# EAGLE design ibmpc (EAGLE 9.6.1)
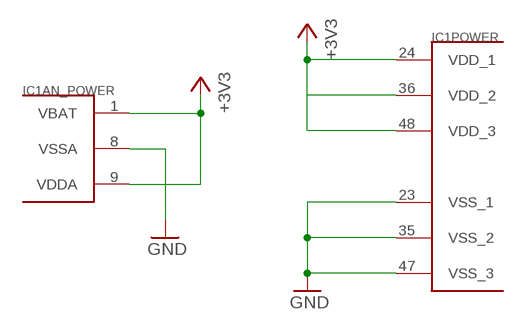
[diagram p0: schematic, sheet 1, part 1 of 2]
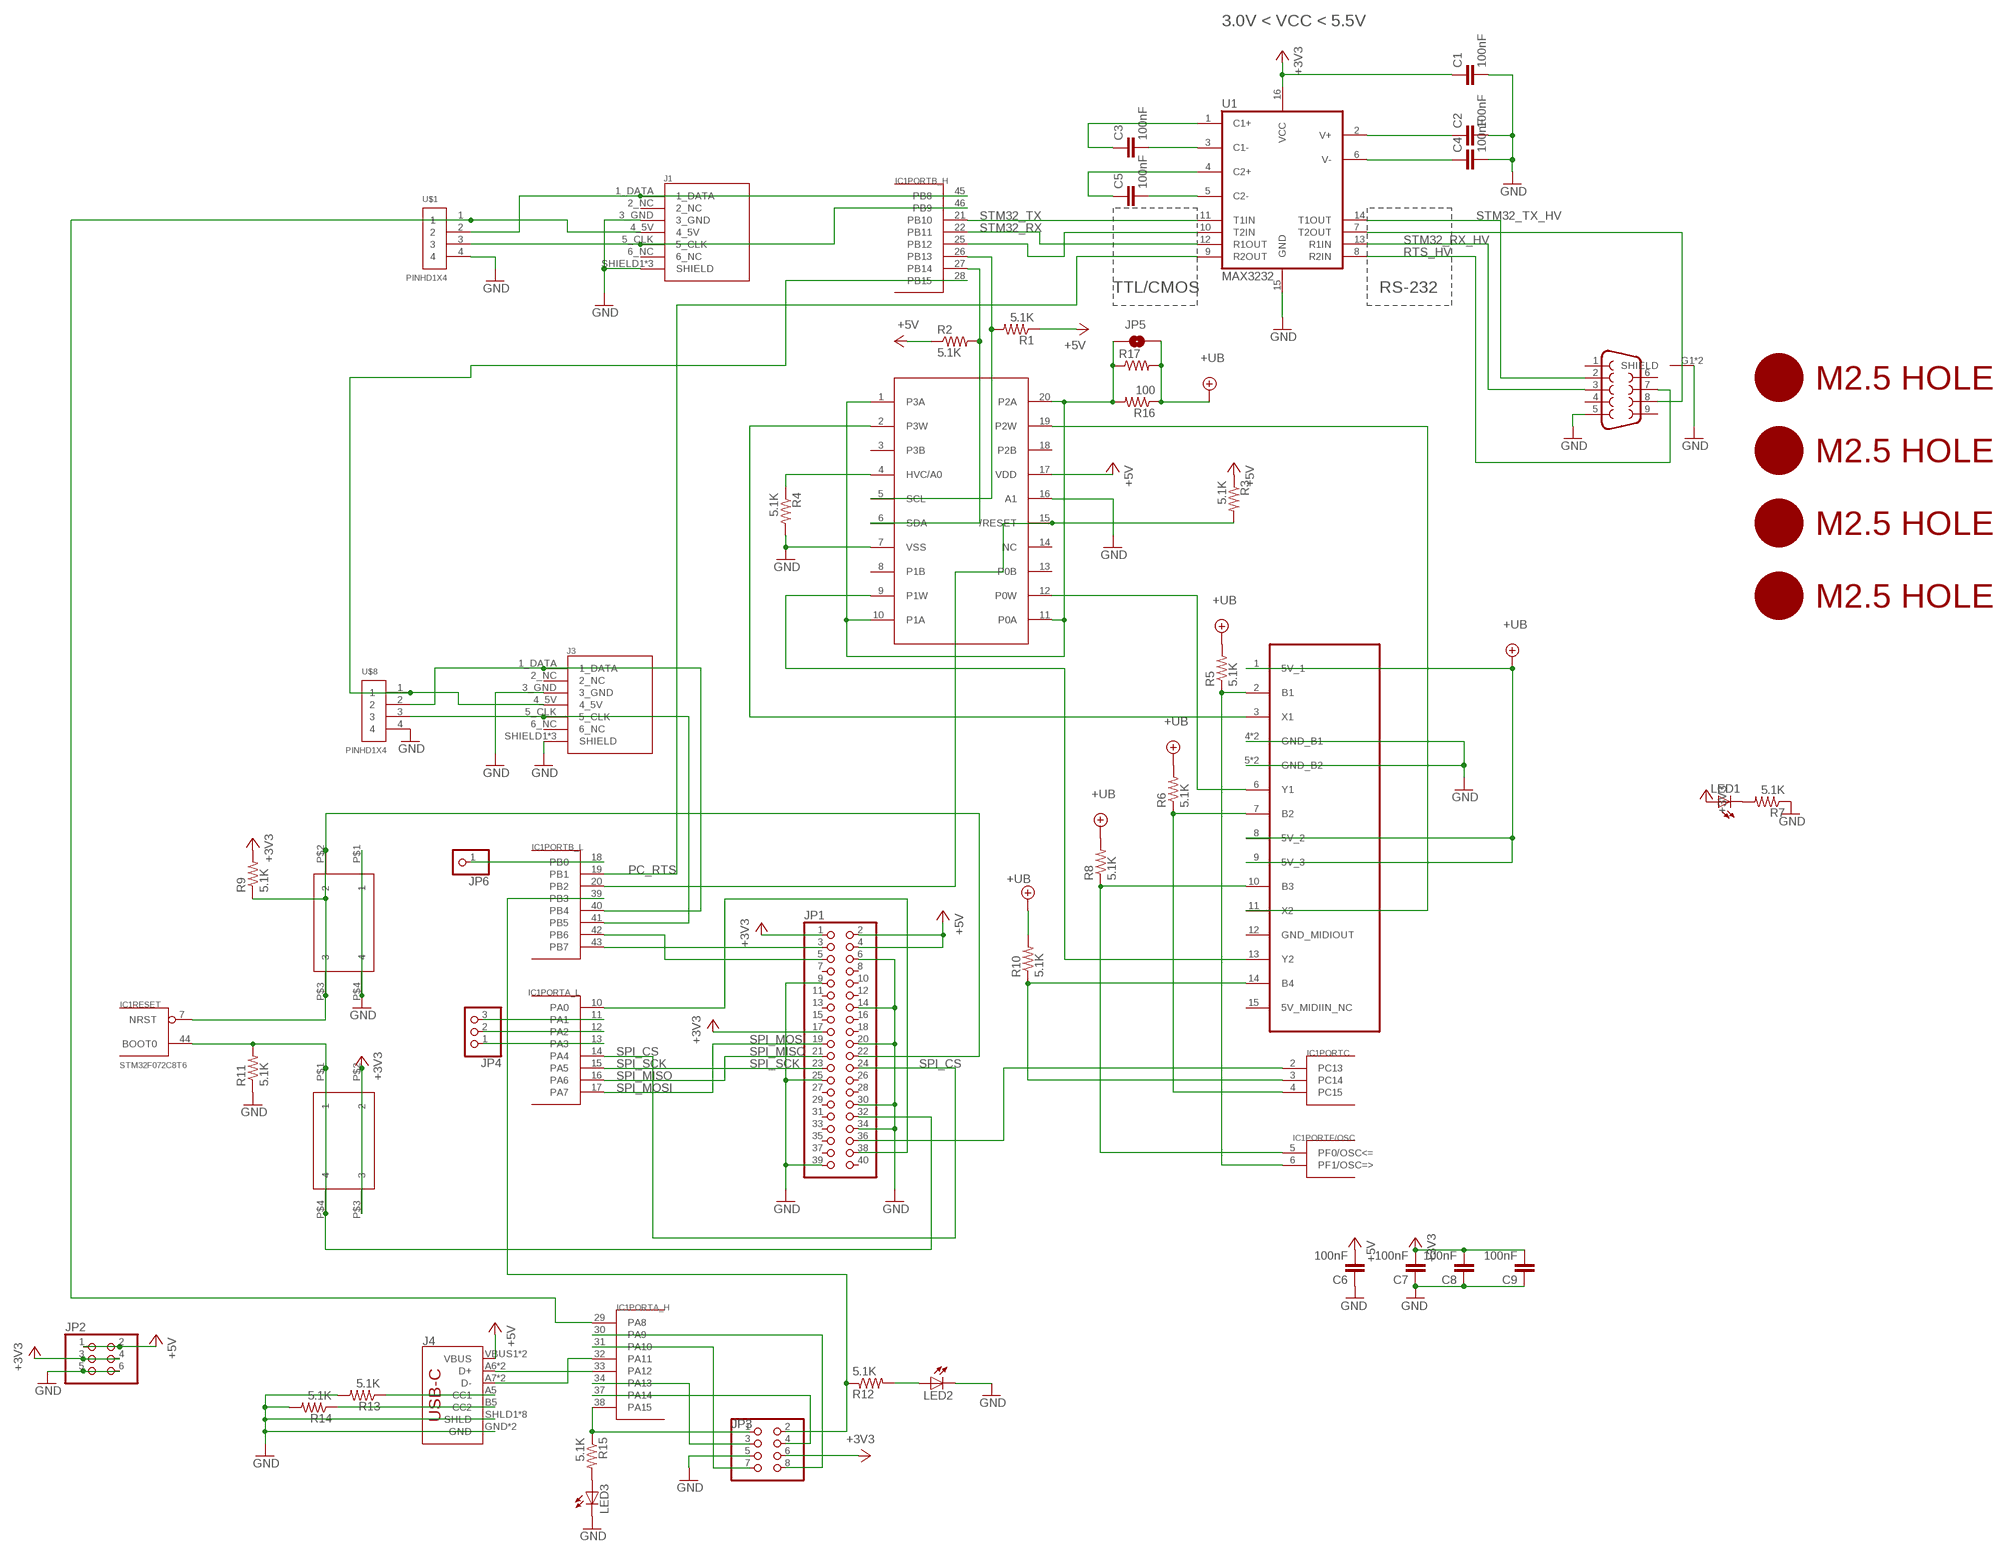
[diagram p1: schematic, sheet 1, part 2 of 2]

## Parts
C1  100nF  CAP0805  [0805@1]
C2  100nF  CAP0805  [0805@1]
C3  100nF  CAP0805  [0805@1]
C4  100nF  CAP0805  [0805@1]
C5  100nF  CAP0805  [0805@1]
C6  100nF  CAP0805  [0805@1]
C7  100nF  CAP0805  [0805@1]
C8  100nF  CAP0805  [0805@1]
C9  100nF  CAP0805  [0805@1]
IC1  STM32F072C8T6  [TQFP48]
J1  DIN7  [DIN7]
J2  DB9MALE  [DB9_MALE]
J3  DIN7  [DIN7]
J4  USB_C16PIN  [USB-C-16P]
JP1  PINHD-2X20-BIG  [2X20-BIG]
JP2  PINHD-2X3  [2X03]
JP3  PINHD-2X4  [2X04]
JP4  PINHD-1X3CB  [1X03-CLEANBIG]
JP5  JUMPER-SMT_2_NO_NO-SILK  [SMT-JUMPER_2_NO_NO-SILK]
JP6  PINHD-1X1CB  [1X01-CLEANBIG]
LED1  LEDCHIP-LED0805  [CHIP-LED0805]
LED2  LEDCHIP-LED0805  [CHIP-LED0805]
LED3  LEDCHIP-LED0805  [CHIP-LED0805]
R1  5.1K  RESISTOR0805-RES  [0805]
R2  5.1K  RESISTOR0805-RES  [0805]
R3  5.1K  RESISTOR0805-RES  [0805]
R4  5.1K  RESISTOR0805-RES  [0805]
R5  5.1K  RESISTOR0805-RES  [0805]
R6  5.1K  RESISTOR0805-RES  [0805]
R7  5.1K  RESISTOR0805-RES  [0805]
R8  5.1K  RESISTOR0805-RES  [0805]
R9  5.1K  RESISTOR0805-RES  [0805]
R10  5.1K  RESISTOR0805-RES  [0805]
R11  5.1K  RESISTOR0805-RES  [0805]
R12  5.1K  RESISTOR0805-RES  [0805]
R13  5.1K  RESISTOR0805-RES  [0805]
R14  5.1K  RESISTOR0805-RES  [0805]
R15  5.1K  RESISTOR0805-RES  [0805]
R16  100  RESISTOR0805-RES  [0805]
R17  R-US_0204/7  [0204/7]
SW1  324_SW  [342_SWICH_FOOT]
SW2  324_SW  [342_SWICH_FOOT]
U1  MAX3232  MAX232SOIC16  [SO016]
U$1  PINHD1X4  [1X04-CLEANBIG]
U$2  M2.5HOLE  [M2.5HOLE]
U$3  M2.5HOLE  [M2.5HOLE]
U$5  MCP4451  [TSSOP20]
U$6  M2.5HOLE  [M2.5HOLE]
U$7  M2.5HOLE  [M2.5HOLE]
U$8  PINHD1X4  [1X04-CLEANBIG]
U$9  GAMEPORT_15P  [DA15]

## Nets
+3V3: C1.1 C7.2 C8.2 C9.2 IC1.1(AN_POWER:VBAT) IC1.9(AN_POWER:VDDA) IC1.24(POWER:VDD_1) IC1.36(POWER:VDD_2) IC1.48(POWER:VDD_3) JP1.1 JP1.17 JP2.3 JP2.4 JP3.6 LED1.A R9.2 SW2.P$2 SW2.P$3 U1.16(VCC)
+5V: C6.2 J4.VBUS1(VBUS) J4.VBUS2(VBUS) JP1.2 JP1.4 JP2.1 JP2.2 R1.1 R2.1 R3.1 U$5.17(VDD)
+UB: JP5.2 R5.2 R6.2 R8.2 R10.2 R16.1 R17.2 U$9.1(5V_1) U$9.8(5V_2) U$9.9(5V_3)
C1+: C3.1 U1.1(C1+)
C1-: C3.2 U1.3(C1-)
C2+: C5.1 U1.4(C2+)
C2-: C5.2 U1.5(C2-)
GND: C1.2 C2.2 C4.2 C6.1 C7.1 C8.1 C9.1 IC1.8(AN_POWER:VSSA) IC1.23(POWER:VSS_1) IC1.35(POWER:VSS_2) IC1.47(POWER:VSS_3) J1.3_GND J1.SHIELD1(SHIELD) J1.SHIELD2(SHIELD) J1.SHIELD3(SHIELD) J2.5 J2.G1(SHIELD) J2.G2(SHIELD) J3.3_GND J3.SHIELD1(SHIELD) J3.SHIELD2(SHIELD) J3.SHIELD3(SHIELD) J4.GND J4.GND2(GND) J4.SHLD1(SHLD) J4.SHLD2(SHLD) J4.SHLD3(SHLD) J4.SHLD4(SHLD) J4.SHLD5(SHLD) J4.SHLD6(SHLD) J4.SHLD7(SHLD) J4.SHLD8(SHLD) JP1.6 JP1.9 JP1.14 JP1.20 JP1.25 JP1.30 JP1.34 JP1.39 JP2.5 JP2.6 JP3.5 LED2.C LED3.C R4.2 R7.1 R11.1 R13.2 R14.2 SW1.P$1 SW1.P$4 U1.15(GND) U$1.4 U$5.7(VSS) U$5.16(A1) U$8.4 U$9.4(GND_B1) U$9.5(GND_B2) U$9.G1(GND_B1) U$9.G2(GND_B2)
N$1: J4.A5(CC1) R13.1
N$2: LED2.A R12.2
N$3: IC1.10(PORTA_L:PA0) JP1.38
N$4: IC1.29(PORTA_H:PA8) J1.4_5V U$1.1
N$5: IC1.41(PORTB_L:PB5) J3.5_CLK U$8.3
N$6: IC1.39(PORTB_L:PB3) JP3.2 R12.1
N$7: J4.B5(CC2) R14.1
N$8: IC1.33(PORTA_H:PA12) J4.A6(D+) J4.B6(D+)
N$9: IC1.32(PORTA_H:PA11) J4.A7(D-) J4.B7(D-)
N$10: IC1.45(PORTB_H:PB8) J1.1_DATA U$1.2
N$11: IC1.46(PORTB_H:PB9) J1.5_CLK U$1.3
N$12: IC1.31(PORTA_H:PA10) JP3.7
N$13: IC1.7(RESET:NRST) JP1.22 R9.1 SW1.P$2 SW1.P$3
N$14: IC1.30(PORTA_H:PA9) JP3.8
N$15: IC1.34(PORTA_H:PA13) JP3.3
N$16: IC1.37(PORTA_H:PA14) JP3.4
N$17: JP5.1 R16.2 R17.1 U$5.1(P3A) U$5.10(P1A) U$5.11(P0A) U$5.20(P2A)
N$18: IC1.44(RESET:BOOT0) JP1.32 R11.2 SW2.P$1 SW2.P$4
N$19: IC1.4(PORTC:PC15) R6.1 U$9.7(B2)
N$20: IC1.5(PORTF/OSC:PF0/OSC<=) R8.1 U$9.10(B3)
N$21: IC1.3(PORTC:PC14) R10.1 U$9.14(B4)
N$22: IC1.42(PORTB_L:PB6) JP1.5
N$23: IC1.43(PORTB_L:PB7) JP1.3
N$24: IC1.25(PORTB_H:PB12) U1.10(T2IN)
N$25: J2.8 U1.7(T2OUT)
N$26: IC1.40(PORTB_L:PB4) J3.1_DATA U$8.2
N$27: IC1.38(PORTA_H:PA15) JP3.1 R15.1
N$28: LED3.A R15.2
N$29: LED1.C R7.2
N$30: IC1.18(PORTB_L:PB0) JP6.1
N$31: IC1.6(PORTF/OSC:PF1/OSC=>) R5.1 U$9.2(B1)
N$32: R4.1 U$5.4(HVC/A0)
N$37: IC1.2(PORTC:PC13) JP1.36
N$39: IC1.11(PORTA_L:PA1) JP4.3
N$40: IC1.12(PORTA_L:PA2) JP4.2
N$41: IC1.13(PORTA_L:PA3) JP4.1
N$43: IC1.28(PORTB_H:PB15) J3.4_5V U$8.1
N$44: IC1.20(PORTB_L:PB2) R3.2 U$5.15(/RESET)
PC_RTS: IC1.19(PORTB_L:PB1) U1.9(R2OUT)
POT_SCL: IC1.26(PORTB_H:PB13) R1.2 U$5.5(SCL)
PST_SDA: IC1.27(PORTB_H:PB14) R2.2 U$5.6(SDA)
RTS_HV: J2.7 U1.8(R2IN)
SPI_CS: IC1.14(PORTA_L:PA4) JP1.24
SPI_MISO: IC1.16(PORTA_L:PA6) JP1.21
SPI_MOSI: IC1.17(PORTA_L:PA7) JP1.19
SPI_SCK: IC1.15(PORTA_L:PA5) JP1.23
STM32_RX: IC1.22(PORTB_H:PB11) U1.12(R1OUT)
STM32_RX_HV: J2.3 U1.13(R1IN)
STM32_TX: IC1.21(PORTB_H:PB10) U1.11(T1IN)
STM32_TX_HV: J2.2 U1.14(T1OUT)
V+: C2.1 U1.2(V+)
V-: C4.1 U1.6(V-)
X1_W3: U$5.2(P3W) U$9.3(X1)
X2_W2: U$5.19(P2W) U$9.11(X2)
Y1_W0: U$5.12(P0W) U$9.6(Y1)
Y2_W1: U$5.9(P1W) U$9.13(Y2)
Unconnected: J1.2_NC J1.6_NC J2.1 J2.4 J2.6 J2.9 J3.2_NC J3.6_NC JP1.7 JP1.8 JP1.10 JP1.11 JP1.12 JP1.13 JP1.15 JP1.16 JP1.18 JP1.26 JP1.27 JP1.28 JP1.29 JP1.31 JP1.33 JP1.35 JP1.37 JP1.40 U$5.3(P3B) U$5.8(P1B) U$5.13(P0B) U$5.14(NC) U$5.18(P2B) U$9.12(GND_MIDIOUT) U$9.15(5V_MIDIIN_NC)

## Notes on the sheet
- 3.0V < VCC < 5.5V
- TTL/CMOS | RS-232

## Library data of the parts
C1-C9 = clock:CAP: Capacitor Standard 0603 ceramic capacitor, and 0.1" leaded capacitor.
IC1 = clock:STM32F072C8T6: ST STM32F072 48pin LQFP
J1 J3 = ibmpc:DIN7: Mini-DIN7 Connector Through-hole MiniDIN 7 connector. Commonly used with Roomba products. Don't confuse this with DIN-6, which is commonly used on oldschool keyboards and mice. Here is the female version connector we sell at SparkFun: MiniDIN 7-Pin Connector <https://www.sparkfun.com/products/696> (PRT-00696); PROD_ID: CONN-08318; SF_ID: PRT-00696
J2 = SparkFun-Connectors:DB9: DB9 Connector Standard DB9 (D-Sub 9) serial connector. Can be used for CAN bus as well as RS485 and RS232. Footprint production proven. Here is the female version connector we sell at SparkFun: 9 Pin Female Serial Connector - PCB Mount <https://www.sparkfun.com/products/429> (PRT-00429) This connector has been used on the following SparkFun products: SparkFun RS232 Shifter - SMD <https://www.sparkfun.com/products/449> (PRT-00449) SparkFun RS232 Shifter SMD (No DB9) <https://www.sparkfun.com/products/8780> (PRT-08780); PROD_ID: CONN-09904
J4 = SparkFun-Connectors:USB_C: USB Type C 16Pin Connector Super Speed pins not available on the 16-pin purely SMD connector so this part is best for USB 2.0 implementations. D1 and D2 are tied together enabling D+/- no matter which way the cable is plugged into the connector. The two channel configuration pins (CC1/2) are exposed. These are normally connected to ground via 5.1k resistors but can be reconfigured for high current/high power applications.; PROD_ID: CONN-14122
JP1 = adafruit_changed:PINHD-2X20: PIN HEADER
JP2 = pinhead:PINHD-2X3: PIN HEADER
JP3 = pinhead:PINHD-2X4: PIN HEADER
JP4 = adafruit:PINHD-1X3: PIN HEADER
JP5 = SparkFun-Jumpers:JUMPER-SMT_2_NO: Normally open jumper This jumper has two pads in close proximity to each other. Apply solder to close the connection. Round pads are easier to solder for beginners, but are a lot larger. SparkFun Product that uses the round pads: SparkFun EL Sequencer <https://www.sparkfun.com/products/12781>
JP6 = adafruit:PINHD-1X1: Pin header 1x1 for 0.1" spacing With round pins
LED1-LED3 = adafruit:LED: LED OSRAM: - CHIPLED LG R971, LG N971, LY N971, LG Q971, LY Q971, LO R971, LY R971 LH N974, LH R974 LS Q976, LO Q976, LY Q976 LO Q996 - Hyper CHIPLED LW Q18S LB Q993, LB Q99A, LB R99A - SideLED LS A670, LO A670, LY A670, LG A670, LP A670 LB A673, LV A673, LT A673, LW A673 LH A674 LY A675 LS A676, LA A676, LO A676, LY A676, LW A676 LS A679, LY A679, LG A679 - Hyper Micro SIDELED® LS Y876, LA Y876, LO Y876, LY Y876 LT Y87S - SmartLED LW L88C, LW L88S LB L89C, LB L89S, LG L890 LS L89K, LO L89K, LY L89K LS L896, LA L896, LO L896, LY L896 - TOPLED LS T670, LO T670, LY T670, LG T670, LP T670 LSG T670, LSP T670, LSY T670, LOP T670, LYG T670 LG T671, LOG T671, LSG T671 LB T673, LV T673, LT T673, LW T673 LH T674 LS T676, LA T676, LO T676, LY T676, LB T676, LH T676, LSB T676, LW T676 LB T67C, LV T67C, LT T67C, LS T67K, LO T67K, LY T67K, LW E67C LS E67B, LA E67B, LO E67B, LY E67B, LB E67C, LV E67C, LT E67C LW T67C LS T679, LY T679, LG T679 LS T770, LO T770, LY T770, LG T770, LP T770 LB T773, LV T773, LT T773, LW T773 LH T774 LS E675, LA E675, LY E675, LS T675 LS T776, LA T776, LO T776, LY T776, LB T776 LHGB T686 LT T68C, LB T68C - Hyper Mini TOPLED® LB M676 - Mini TOPLED Santana® LG M470 LS M47K, LO M47K, LY M47K Source: http://www.osram.convergy.de/
R1-R16 = SparkFun-Passives:RESISTOR: Resistor Basic schematic elements and footprints for 0603, 1206, and PTH resistors.
R17 = adafruit:R-US_: RESISTOR, American symbol
SW1 SW2 = 3pos_slide_switch_centered:324_SW
U1 = SparkFun-DigitalIC:MAX232: RS232 Transceiver Very common IC. This is generically called 'MAX232', but works with the 3V equivalent MAX3232 generic ICs. Field tested and mother approved. Spark Fun Electronics SKU : COM-00316 (DIP) and COM-00589 (SMD); PROD_ID: IC-08171
U$1 U$8 = adafruit_changed:PINHD1X4
U$2 U$3 U$6 U$7 = f1c100s:M2.5HOLE
U$5 = ps2:MCP4451
U$9 = ibmpc:GAMEPORT_15P

## Net classes
1 power: width 0.178 mm

## Board
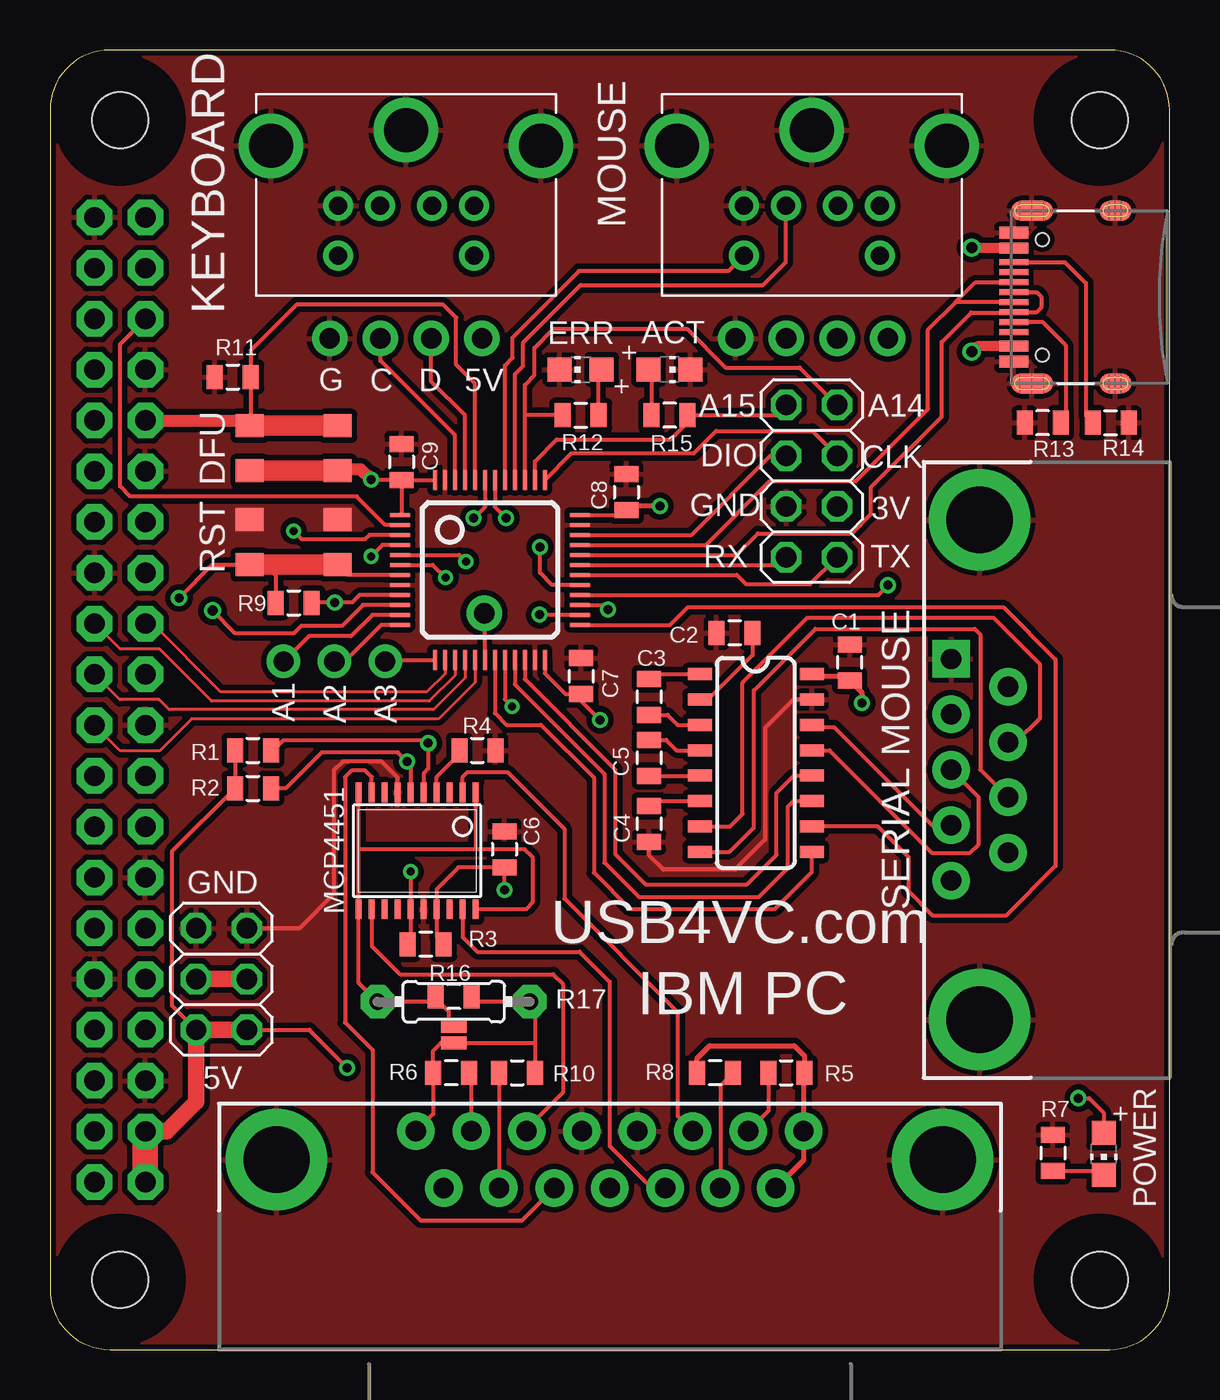
[diagram p2: board, top side]
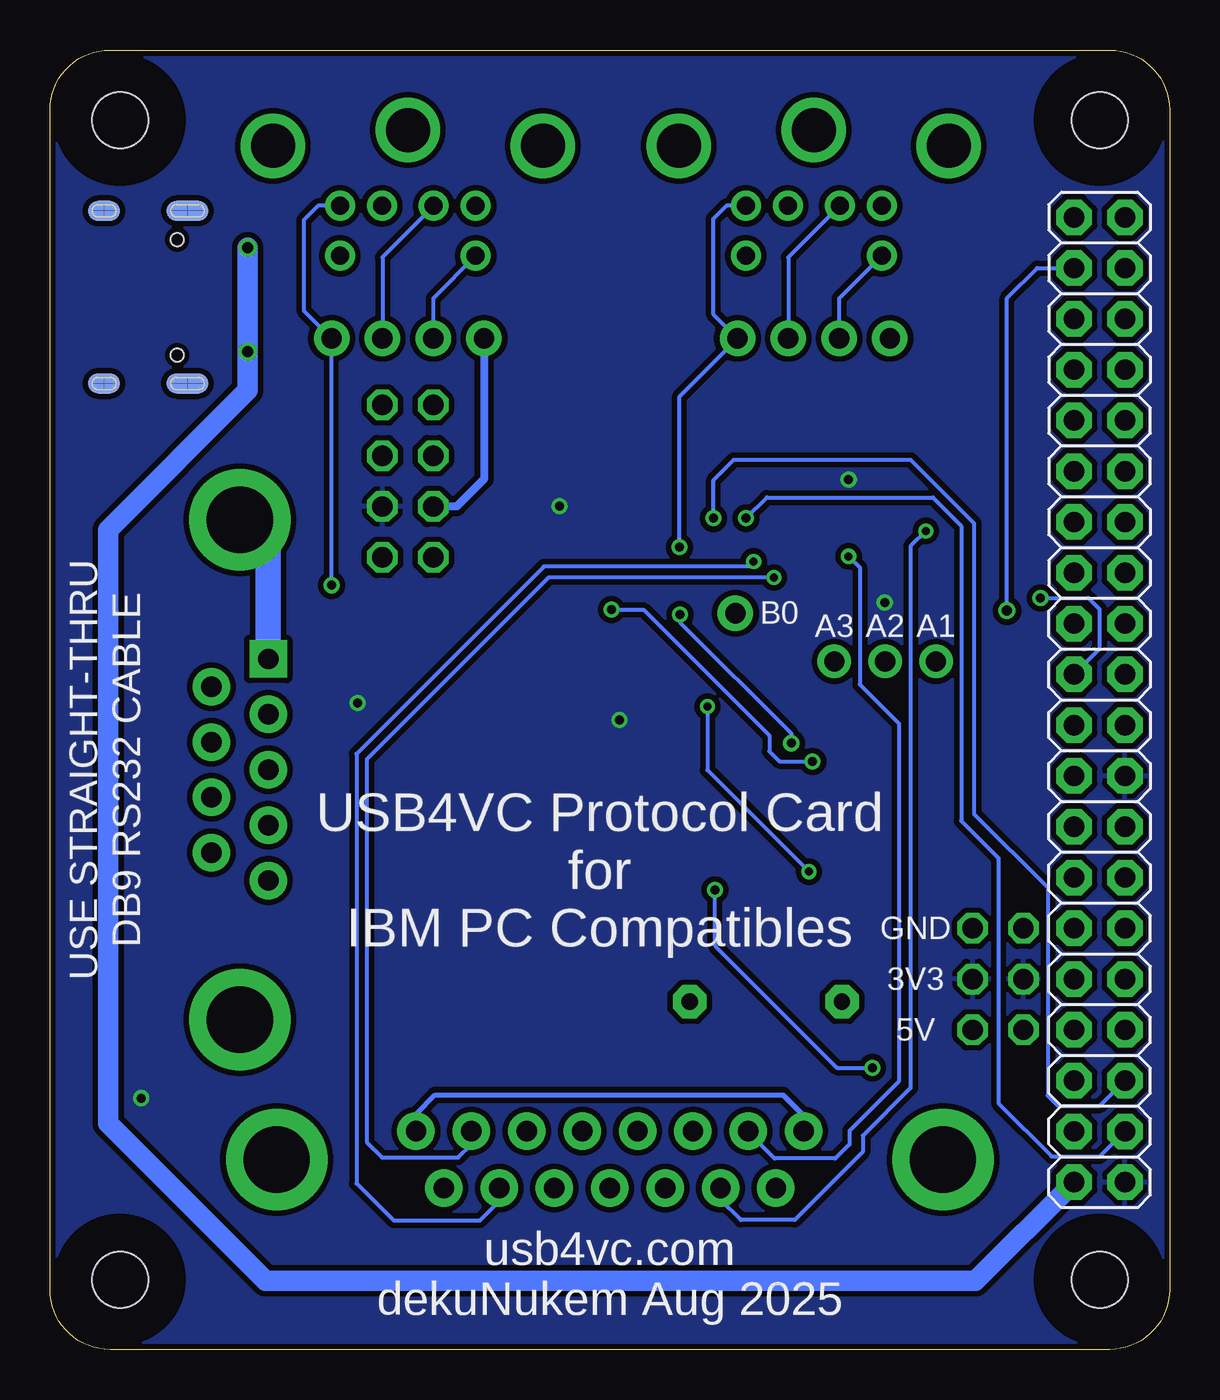
[diagram p3: board, bottom side, seen from below]

Size 56 x 65 mm. Coordinates in mm from the lower left corner, seen from the top.
Outline: 3,0 53,0 arc90 56,3 56,62 arc90 53,65 3,65 arc90 0,62 0,3 arc90 3,0
Copper layers (1*16): Top 0.035mm / dielectric 1.5mm / Bottom 0.035mm
Design rules "deku_2layer_6mil": minimum track width 6mil, minimum drill 15mil, track to track 6mil, track to pad 6mil, pad to pad 6mil, via to via 6mil, smd to smd 6mil, copper to edge 10mil, drill to drill 6mil, minimum pad ring 7mil, minimum via ring 7mil, stop-mask expansion 4mil, vias tented up to drill 25mil, thermal gap 10mil

### Footprints (pad centres in the part's own frame; a part is rotated, then mirrored left to right if it is on the bottom)
0805@1 = smd 0.8 x 1.2: 1 -0.9,0; 2 0.9,0
TQFP48 = smd 0.2 x 1: 1 -2.75,-4.5; 2 -2.25,-4.5; 3 -1.75,-4.5; 4 -1.25,-4.5; 5 -0.75,-4.5; 6 -0.25,-4.5; 7 0.25,-4.5; 8 0.75,-4.5; 9 1.25,-4.5; 10 1.75,-4.5; 11 2.25,-4.5; 12 2.75,-4.5; 25 2.75,4.5; 26 2.25,4.5; 27 1.75,4.5; 28 1.25,4.5; 29 0.75,4.5; 30 0.25,4.5; 31 -0.25,4.5; 32 -0.75,4.5; 33 -1.25,4.5; 34 -1.75,4.5; 35 -2.25,4.5; 36 -2.75,4.5 | smd 1 x 0.2: 13 4.5,-2.75; 14 4.5,-2.25; 15 4.5,-1.75; 16 4.5,-1.25; 17 4.5,-0.75; 18 4.5,-0.25; 19 4.5,0.25; 20 4.5,0.75; 21 4.5,1.25; 22 4.5,1.75; 23 4.5,2.25; 24 4.5,2.75; 37 -4.5,2.75; 38 -4.5,2.25; 39 -4.5,1.75; 40 -4.5,1.25; 41 -4.5,0.75; 42 -4.5,0.25; 43 -4.5,-0.25; 44 -4.5,-0.75; 45 -4.5,-1.25; 46 -4.5,-1.75; 47 -4.5,-2.25; 48 -4.5,-2.75
DIN7 = drill 0.9 pad 1.5: 1_DATA -1.3,-3.8; 2_NC 1.3,-3.8; 3_GND -3.4,-3.8; 4_5V 3.4,-3.8; 5_CLK -3.4,-6.3; 6_NC 3.4,-6.3 | drill 2.2: SHIELD1 -6.75,-0.8; SHIELD2 0,0; SHIELD3 6.75,-0.8
DB9_MALE = drill 1.016 pad 1.88: 1 5.54,-1.42; 2 2.77,-1.42; 3 0,-1.42; 4 -2.77,-1.42; 6 4.15,1.42; 7 1.38,1.42; 8 -1.38,1.42; 9 -4.15,1.42 | drill 1.016 pad 1.88 square: 5 -5.54,-1.42 | drill 3.302 pad 5.08: G1 -12.5,0; G2 12.5,0
USB-C-16P = smd 0.3 x 1.45: A5 -1.25,0; A6 -0.25,0; A7 0.25,0; A8 1.25,0; B5 1.75,0; B6 0.75,0; B7 -0.75,0; B8 -1.75,0 | smd 0.6 x 1.45: GND -3.225,0; GND2 3.225,0 | smd 1 x 2.1: SHLD1 -4.32,-0.915; SHLD2 4.32,-0.915 | smd 1 x 2.1 bottom: SHLD3 -4.32,-0.915; SHLD4 4.32,-0.915 | smd 1 x 1.6: SHLD5 -4.32,-5.095; SHLD8 4.32,-5.095 | smd 1 x 1.6 bottom: SHLD6 -4.32,-5.095; SHLD7 4.32,-5.095 | smd 0.55 x 1.45: VBUS1 -2.45,0; VBUS2 2.45,0 | hole 0.65: -2.89,-1.445; 2.89,-1.445
2X20-BIG = drill 1.016 pad 1.778 octagon: 1 -24.13,-1.27; 2 -24.13,1.27; 3 -21.59,-1.27; 4 -21.59,1.27; 5 -19.05,-1.27; 6 -19.05,1.27; 7 -16.51,-1.27; 8 -16.51,1.27; 9 -13.97,-1.27; 10 -13.97,1.27; 11 -11.43,-1.27; 12 -11.43,1.27; 13 -8.89,-1.27; 14 -8.89,1.27; 15 -6.35,-1.27; 16 -6.35,1.27; 17 -3.81,-1.27; 18 -3.81,1.27; 19 -1.27,-1.27; 20 -1.27,1.27; 21 1.27,-1.27; 22 1.27,1.27; 23 3.81,-1.27; 24 3.81,1.27; 25 6.35,-1.27; 26 6.35,1.27; 27 8.89,-1.27; 28 8.89,1.27; 29 11.43,-1.27; 30 11.43,1.27; 31 13.97,-1.27; 32 13.97,1.27; 33 16.51,-1.27; 34 16.51,1.27; 35 19.05,-1.27; 36 19.05,1.27; 37 21.59,-1.27; 38 21.59,1.27; 39 24.13,-1.27; 40 24.13,1.27
2X03 = drill 1.016 octagon: 1 -2.54,-1.27; 2 -2.54,1.27; 3 0,-1.27; 4 0,1.27; 5 2.54,-1.27; 6 2.54,1.27
2X04 = drill 1.016 octagon: 1 -3.81,-1.27; 2 -3.81,1.27; 3 -1.27,-1.27; 4 -1.27,1.27; 5 1.27,-1.27; 6 1.27,1.27; 7 3.81,-1.27; 8 3.81,1.27
1X03-CLEANBIG = drill 1.016 pad 1.676: 1 -2.54,0; 2 0,0; 3 2.54,0
SMT-JUMPER_2_NO_NO-SILK = smd 0.635 x 1.27: 1 -0.406,0; 2 0.406,0
1X01-CLEANBIG = drill 1.016 pad 1.778: 1 0,0
CHIP-LED0805 = smd 1.2 x 1.2: A 0,-1.05; C 0,1.05
0805 = smd 0.8 x 1.2: 1 -0.9,0; 2 0.9,0
0204/7 = drill 0.813 pad 1.676 octagon: 1 -3.81,0; 2 3.81,0
342_SWICH_FOOT = smd 1.4 x 1.15: P$1 -2.2,-1.125; P$2 -2.2,1.125; P$3 2.2,1.125; P$4 2.2,-1.125
SO016 = smd 0.6 x 1.2: 1 -4.445,-2.8; 2 -3.175,-2.8; 3 -1.905,-2.8; 4 -0.635,-2.8; 5 0.635,-2.8; 6 1.905,-2.8; 7 3.175,-2.8; 8 4.445,-2.8; 9 4.445,2.8; 10 3.175,2.8; 11 1.905,2.8; 12 0.635,2.8; 13 -0.635,2.8; 14 -1.905,2.8; 15 -3.175,2.8; 16 -4.445,2.8
1X04-CLEANBIG = drill 1.016 pad 1.778: 1 -3.81,0; 2 -1.27,0; 3 1.27,0; 4 3.81,0
M2.5HOLE = hole 2.8: 0,0
TSSOP20 = smd 0.305 x 0.991: 1 -2.925,-2.918; 2 -2.275,-2.918; 3 -1.625,-2.918; 4 -0.975,-2.918; 5 -0.325,-2.918; 6 0.325,-2.918; 7 0.975,-2.918; 8 1.625,-2.918; 9 2.275,-2.918; 10 2.925,-2.918; 11 2.925,2.918; 12 2.275,2.918; 13 1.625,2.918; 14 0.975,2.918; 15 0.325,2.918; 16 -0.325,2.918; 17 -0.975,2.918; 18 -1.625,2.918; 19 -2.275,2.918; 20 -2.925,2.918
DA15 = drill 1.016 pad 1.88: 1 -9.69,-1.42; 2 -6.92,-1.42; 3 -4.15,-1.42; 4 -1.38,-1.42; 5 1.39,-1.42; 6 4.16,-1.42; 7 6.93,-1.42; 8 9.7,-1.42; 9 -8.3,1.42; 10 -5.53,1.42; 11 -2.77,1.42; 12 0,1.42; 13 2.77,1.42; 14 5.54,1.42; 15 8.31,1.42 | drill 3.302 pad 5.08: G1 -16.66,0; G2 16.67,0

### Placement (x,y rotation side)
C1  40.01,34.37 90 top
C2  34.24,35.84 180 top
C3  29.97,32.64 270 top
C4  29.97,26.29 270 top
C5  29.97,29.59 270 top
C6  22.73,25.02 270 top
C7  26.57,33.68 270 top
C8  28.83,42.88 270 top
C9  17.58,44.4 270 top
IC1  22,39 270 top
J1  17.8,61 0 top
J2  46.5,29 270 top
J3  38.1,61 0 top
J4  48.2,52.63 90 top
JP1  3.5,32.5 90 bottom
JP2  8.58,18.53 90 top
JP3  38.1,43.43 270 top
JP4  14.22,34.42 180 top
JP5  20.19,15.75 270 top
JP6  21.72,36.83 0 top
LED1  52.7,9.78 180 top
LED2  26.54,49.02 90 top
LED3  30.99,49.02 270 top
R1  10.16,29.97 0 top
R2  10.16,28.07 0 top
R3  18.8,20.27 180 top
R4  21.39,29.97 0 top
R5  36.83,13.84 0 top
R6  20.07,13.84 180 top
R7  50.16,9.83 270 top
R8  33.27,13.84 180 top
R9  12.19,37.34 0 top
R10  23.37,13.84 0 top
R11  9.14,48.64 0 top
R12  26.54,46.74 0 top
R13  49.66,46.35 180 top
R14  53.06,46.35 0 top
R15  30.99,46.74 180 top
R16  20.19,17.65 180 top
R17  20.19,17.4 0 top
SW1  12.19,40.39 180 top
SW2  12.19,45.09 180 top
U1  35.31,29.34 270 top
U$1  17.8,50.57 180 top
U$2  3.5,3.5 0 top
U$3  52.5,3.5 0 top
U$5  18.36,24.94 180 top
U$6  3.5,61.5 0 top
U$7  52.5,61.5 0 top
U$8  38.1,50.57 180 top
U$9  28,9.5 180 top

### Tracks (layer width: path | path; a pad name or v marks a point on that pad's centre or on a via)
+3V3  (via drill 0.45)
  Top 0.203: v16.05,43.51 17.57,43.51 C9.2 | C9.2 IC1.48 | C9.2 17.58,41.83 IC1.1 | v27.51,31.5 26.57,32.44 C7.2 25.79,32.78 24.75,33.82 IC1.24 | R9.2 13.12,37.36 v14.25,37.36 15.11,37.36 15.5,37.75 IC1.9 | v51.44,12.57 51.98,12.57 52.7,11.85 LED1.A | IC1.36 28.63,41.75 28.84,41.96 29.07,42.19
  Top 0.254: U1.16 38.35,33.78 38.48,33.66 39.82,33.66 C1.1 40.62,32.86 v40.62,32.33 | v30.5,42.19 29.07,42.19 | 28.84,41.96 C8.2
  Top 0.61: v16.05,43.51 15.54,44.02 14.45,44.02 SW2.P$2
  Top 0.813: JP2.3 JP2.4
  Top 1.016: SW2.P$3 SW2.P$2
  pour Bottom (isolate 0.279, rank 2): 0,3 0,62 arc-90 3,65 53,65 arc-90 56,62 56,3 arc-90 53,0 3,0 arc-90
+5V  (via drill 0.45, 0.55)
  Top 0.203: JP2.2 6.1,17.2 6.1,24.9 R2.1 R1.1 | JP2.1 12.97,15.99 v14.86,14.1 | v22.73,22.99 C6.2 20.44,24.12 19.34,23.02 U$5.17 19.34,20.63 R3.1
  Top 0.508: J4.VBUS2 46.13,55.09 v46.1,55.12 | J4.VBUS1 46.38,50.19 v46.1,49.91
  Top 0.813: JP1.4 5.83,10.91 7.31,12.39 JP2.2 JP2.1
  Top 1.27: JP1.4 JP1.2
  Bottom 0.203: v14.86,14.1 16.64,14.1 22.73,20.19 v22.73,22.99
  Bottom 1.016: JP1.2 9.71,3.43 45.21,3.43 53.09,11.3 53.09,41 46.1,47.98 v46.1,49.91 v46.1,55.12
+UB
  Top 0.203: U$9.8 19.17,11.79 R6.2 19.17,14.95 19.56,15.34 JP5.2 24.24,15.34 24.27,15.37 | 24.27,15.37 24.27,17.13 R17.2 21.35,17.4 R16.1 | 24.27,15.37 R10.2
  Top 0.254: R8.2 32.37,14.57 32.99,15.19 37.24,15.19 37.73,14.7 R5.2 37.69,13.8 U$9.1 37.69,9.47 U$9.9
  Bottom 0.254: U$9.1 37.69,11.76 36.73,12.72 19.33,12.72 18.3,11.7 U$9.8
C1+
  Top 0.203: C3.1 30.21,33.78 U1.1
C1-
  Top 0.203: C3.2 30.9,31.74 31.39,31.24 U1.3
C2+
  Top 0.203: C5.1 30.82,30.49 31.34,29.97 U1.4
C2-
  Top 0.203: C5.2 32.49,28.69 U1.5
GND
  Top 0.203: U1.15 37.19,32.51 35.76,31.09 35.76,25.5 34.27,24 30.68,24 29.97,24.71 C4.2 | U$5.7 17.39,28.61 16.59,29.41 14.66,29.41 14.2,28.96 14.2,22.78 12.48,21.07 JP2.5
  Bottom 0.406: U$8.4 34.29,43.54 35.66,42.16 JP3.5
  Bottom 1.27: J2.5 45.08,40.08 J2.G1
  pour Top (isolate 0.279): 3,0 53,0 arc90 56,3 56,62 arc90 53,65 3,65 arc90 0,62 0,3 arc90
N$1
  Top 0.203: R13.1 50.81,46.61 50.81,50.23 49.66,51.38 J4.A5
N$2
  Top 0.203: R12.2 27.44,48.87 LED2.A
N$3  (via drill 0.5)
  Top 0.203: IC1.10 15.66,37.25 14.61,36.2 12.57,36.2 12.19,35.81 9.27,35.81 v8.13,36.96
  Bottom 0.203: v8.13,36.96 8.13,52.58 6.62,54.09 JP1.38
N$4  (via drill 0.45)
  Top 0.203: IC1.29 25.12,38.25 24.51,38.86 v24.51,40.13
  Bottom 0.203: J1.4_5V 22.18,57.2 22.84,56.54 22.84,51.8 U$1.1 24.51,47.67 v24.51,40.13
N$5
  Top 0.203: IC1.41 22.75,49.22 23.14,49.61 23.14,50.62 26.45,53.94 33.94,53.94 J3.5_CLK
  Bottom 0.203: J3.5_CLK 36.83,52.57 U$8.3
N$6
  Top 0.203: JP3.2 37.49,49.12 33.78,49.12 31.85,51.05 25.2,51.05 24.23,50.09 24.23,48.73 23.75,48.25 23.75,46.74 | IC1.39 23.75,46.74 | R12.1 23.75,46.74
N$7
  Top 0.203: J4.B5 50.77,54.38 51.82,53.34 51.82,46.7 R14.1
N$8
  Top 0.203: IC1.33 32.81,40.25 35.99,43.43 40.31,43.43 43.92,47.04 43.92,51 45.29,52.38 45.3,52.38 | J4.B6 46.3,53.38 45.3,52.38 | J4.A6 45.3,52.38
N$9
  Top 0.152: 48.22,51.87 J4.B7
  Top 0.203: IC1.32 34.34,39.75 35.41,40.82 40.11,40.82 41.07,41.78 41.07,43.13 44.6,46.66 44.6,50.39 46.08,51.87 48.22,51.87 49.33,51.87 49.58,52.12 49.58,52.65 49.35,52.88 J4.A7
N$10
  Top 0.203: IC1.45 20.75,46.74 19.07,48.42 U$1.2
  Bottom 0.203: J1.1_DATA 19.07,54.63 U$1.2
N$11
  Top 0.203: IC1.46 20.25,45.74 16.53,49.46 U$1.3
  Bottom 0.203: J1.5_CLK 16.53,52.57 U$1.3
N$12
  Top 0.203: IC1.31 36.46,39.25 JP3.7
N$13  (via drill 0.45)
  Top 0.203: IC1.7 14.9,38.75 SW1.P$2 | 10.74,39.26 11.29,38.71 R9.1 | v6.45,37.59 8.12,39.26 SW1.P$3
  Top 1.016: SW1.P$3 10.74,39.26 SW1.P$2
  Bottom 0.203: JP1.22 3.5,35.03 3.5,37.03 4.06,37.59 v6.45,37.59
N$14
  Top 0.203: IC1.30 34.35,38.75 34.82,38.28 38.02,38.28 JP3.8
N$15
  Top 0.203: IC1.34 32.09,40.75 36.04,44.7 JP3.3
N$16
  Top 0.203: IC1.37 26.08,44.83 32.21,44.83 33.33,45.95 38.12,45.95 JP3.4
N$17
  Top 0.203: U$5.20 23.8,22.02 24.13,22.35 24.13,24.64 23.75,25.02 21.34,25.02 | 21.34,25.02 15.44,25.02 | 15.44,25.02 U$5.11 15.44,18.34 R17.1 19.04,17.4 R16.2 19.29,17.56 19.94,16.92 19.94,16.41 JP5.1 | 15.44,25.02 U$5.10 | U$5.1 21.29,25.07 21.34,25.02
N$18
  Top 0.203: IC1.44 21.25,48.32 20.32,49.25 20.32,51.61 19.66,52.27 12.34,52.27 10.04,49.97 R11.2 10.04,46.26 SW2.P$4
  Top 0.61: JP1.32 9.73,46.47 SW2.P$4
  Top 1.016: SW2.P$4 SW2.P$1
N$19  (via drill 0.4)
  Top 0.203: IC1.4 16.63,40.25 v16.05,39.67 | R6.1 21.07,13.74 U$9.7
  Bottom 0.203: v16.05,39.67 15.49,39.12 15.49,33.27 13.54,31.32 13.54,13.41 16,10.95 16,10.26 16.71,9.55 19.76,9.55 21.07,10.86 U$9.7
N$20  (via drill 0.4)
  Top 0.203: IC1.5 20.47,39.75 v20.8,39.42 | R8.1 33.53,13.2 U$9.10
  Bottom 0.203: v20.8,39.42 21.06,39.17 31.29,39.17 40.66,29.79 40.66,8.31 38.81,6.45 34.49,6.45 33.53,7.42 U$9.10
N$21  (via drill 0.4)
  Top 0.203: IC1.3 15.98,40.75 15.75,40.51 12.62,40.51 v12.19,40.95 | R10.1 U$9.14
  Bottom 0.203: v12.19,40.95 12.95,40.18 12.95,13.08 15.34,10.69 15.34,9.88 18.75,6.48 21.44,6.48 22.46,7.5 U$9.14
N$22  (via drill 0.45)
  Top 0.203: IC1.42 22.25,42.14 v22.81,41.58
  Bottom 0.203: v22.81,41.58 22.81,43.48 21.79,44.5 12.95,44.5 9.78,41.33 9.78,26.8 6.1,23.11 6.1,12.7 5.59,12.19 3.49,12.19 JP1.5
N$23  (via drill 0.45)
  Top 0.203: IC1.43 21.75,42.15 v21.18,41.58
  Bottom 0.203: v21.18,41.58 20.14,42.62 11.84,42.62 10.41,41.2 10.41,26.44 8.56,24.59 8.56,12.32 5.89,9.65 3.49,9.65 JP1.3
N$24
  Top 0.203: IC1.25 31.02,36.25 31.9,37.13 47.68,37.13 50.29,34.52 50.29,24.18 47.8,21.69 44.17,21.69 42.95,22.91 42.95,24.61 41.4,26.16 U1.10
N$25
  Top 0.203: U1.7 34.01,26.16 34.65,26.8 34.65,33.35 37.9,36.6 47.19,36.6 49.51,34.29 49.51,31.57 48.31,30.38 J2.8
N$26
  Top 0.203: IC1.40 23.25,48.78 23.67,49.2 23.67,50.37 26.54,53.24 35.66,53.24 36.8,54.38 J3.1_DATA
  Bottom 0.203: J3.1_DATA 39.37,54.63 U$8.2
N$27
  Top 0.203: IC1.38 24.25,44.42 25.35,45.52 31.05,45.52 31.89,46.35 R15.1 36.32,46.74 JP3.1
N$28
  Top 0.203: LED3.A 30.09,48.87 R15.2
N$29
  Top 0.203: R7.2 52.5,8.93 LED1.C
N$30
  Top 0.203: IC1.18 21.75,36.8 JP6.1
N$31  (via drill 0.4)
  Top 0.203: IC1.6 19.14,39.25 v19.79,38.61 | R5.1 35.93,11.93 U$9.2
  Bottom 0.203: v19.79,38.61 31.06,38.61 40.16,29.52 40.16,10.36 39.4,9.6 35.59,9.6 34.92,10.27 U$9.2
N$32
  Top 0.203: U$5.4 19.34,28.64 20.49,29.78 R4.1
N$37
  Top 0.203: IC1.2 16.76,41.25 15.34,42.67 4.01,42.67 3.5,43.18 3.5,50.28 JP1.36
N$39
  Top 0.203: IC1.11 16.12,36.75 15.06,35.69 12.95,35.69 JP4.3
N$40
  Top 0.203: JP4.2 14.73,34.42 16.57,36.25 IC1.12
N$41
  Top 0.203: JP4.1 16.85,34.5 IC1.13
N$43  (via drill 0.45)
  Top 0.203: IC1.28 41.43,37.75 v41.91,38.23
  Bottom 0.203: J3.4_5V 42.6,57.2 43.31,56.49 43.31,51.97 U$8.1 v41.91,38.23
N$44  (via drill 0.4)
  Top 0.203: IC1.20 22.75,32.52 v23.11,32.16 | v18.03,23.9 U$5.15 18.04,20.41 R3.2
  Bottom 0.203: v23.11,32.16 23.11,28.98 v18.03,23.9
PC_RTS
  Top 0.203: IC1.19 22.25,31.83 22.84,31.24 24.56,31.24 27.2,28.6 27.2,23.85 29.01,22.05 36.27,22.05 38.11,23.88 U1.9
POT_SCL  (via drill 0.45)
  Top 0.203: IC1.26 v24.49,36.75 | U$5.5 18.69,28.82 18.92,29.06 v18.92,30.33 18.8,30.45 11.66,30.45 11.12,29.91 R1.2
  Bottom 0.203: v24.49,36.75 24.49,36.37 18.92,30.81 v18.92,30.33
PST_SDA  (via drill 0.45)
  Top 0.203: IC1.27 27.67,37.25 v27.91,37.01 | U$5.6 18.04,29.23 v17.86,29.41 17.4,29.87 13.59,29.87 11.79,28.07 R2.2
  Bottom 0.203: v27.91,37.01 26.31,37.01 20.02,30.71 20.02,29.92 19.51,29.41 v17.86,29.41
RTS_HV
  Top 0.203: U1.8 33.98,24.89 35.2,26.11 35.2,32.97 38.28,36.04 46.25,36.04 46.53,35.76 46.53,29.01 J2.7
SPI_CS
  Top 0.152: IC1.14 19.75,33.8 18.85,32.89 8.54,32.89 5.13,36.31 JP1.24
SPI_MISO
  Top 0.152: IC1.16 20.75,33.58 19.18,32 5.97,32 5.46,32.51 3.49,32.51 JP1.21
SPI_MOSI
  Top 0.152: JP1.19 3.51,29.95 5.49,29.95 7.09,31.55 19.43,31.55 21.25,33.37 IC1.17
SPI_SCK
  Top 0.152: IC1.15 20.25,33.71 18.97,32.44 8.08,32.44 5.49,35.03 3.51,35.03 JP1.23
STM32_RX
  Top 0.203: IC1.22 23.75,33.53 28.27,29.01 28.27,24.79 29.79,23.27 34.87,23.27 36.35,24.74 36.35,27.84 37.21,28.7 U1.12
STM32_RX_HV
  Top 0.203: J2.3 46.46,27.62 46.46,25.27 46.02,24.84 44.12,24.84 38.99,29.97 U1.13
STM32_TX
  Top 0.203: IC1.21 23.25,33.27 27.74,28.78 27.74,24.36 29.46,22.63 35.46,22.63 36.91,24.08 36.91,27.15 37.19,27.43 U1.11
STM32_TX_HV
  Top 0.203: U1.14 38.23,31.11 39.23,31.11 44.12,26.23 J2.2
V+
  Top 0.203: C2.1 35.14,34.73 32.92,32.51 U1.2
V-
  Top 0.203: C4.1 30.21,27.43 U1.6
X1_W3
  Top 0.203: U$5.2 20.64,28.64 20.88,28.88 22.89,28.88 25.73,26.04 25.73,22.55 31.39,16.89 31.39,11.68 U$9.3
X2_W2
  Top 0.203: U$5.19 20.64,20.64 21.39,19.89 26.49,19.89 27.99,18.39 27.99,10.19 30.1,8.08 U$9.11
Y1_W0
  Top 0.203: U$5.12 16.09,20.18 17.5,18.77 25.17,18.77 25.65,18.29 25.65,12.86 23.84,11.05 U$9.6
Y2_W1
  Top 0.203: U$5.9 16.09,28.64 15.77,28.96 15.09,28.96 14.76,28.63 14.76,16.36 16.13,14.99 16.13,8.87 18.54,6.45 23.6,6.45 U$9.13

### Text on the board
tNames: MOUSE | KEYBOARD | ERR | ACT | G | C | D | 5V | A15 | A14 | DFU | DIO | CLK | GND | 3V | RST | RX | TX | A1 | A2 | A3 | SERIAL MOUSE | GND | USB4VC.com | IBM PC | 5V | POWER
bNames: B0 | A1 | A2 | A3 | USE STRAIGHT-THRU / DB9 RS232 CABLE | USB4VC Protocol Card / for / IBM PC Compatibles | GND | 3V3 | 5V | usb4vc.com / dekuNukem Aug 2025